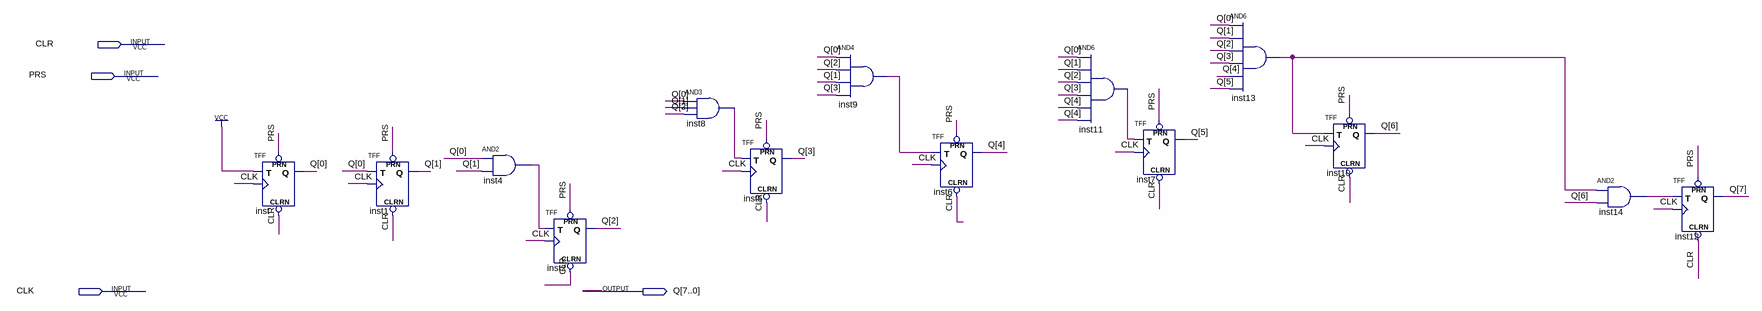
[diagram p0: schematic sheet]
// Quartus schematic counter.bdf as structural Verilog: 14 symbols, 4 pins
module counter (
  input  CLR,
  input  PRS,
  input  CLK,
  output [7:0] Q
);

  wire inst4_out, inst8_out, inst9_out, inst11_out, inst13_out, inst14_out;

  TFF inst (.PRN(PRS), .CLRN(CLR), .T(1'b1), .CLK(CLK), .Q(Q[0]));
  TFF inst1 (.PRN(PRS), .CLRN(CLR), .T(Q[0]), .CLK(CLK), .Q(Q[1]));
  and inst4 (inst4_out, Q[0], Q[1]);
  TFF inst2 (.PRN(PRS), .CLRN(CLR), .T(inst4_out), .CLK(CLK), .Q(Q[2]));
  and inst8 (inst8_out, Q[0], Q[1], Q[2]);
  TFF inst5 (.PRN(PRS), .CLRN(CLR), .T(inst8_out), .CLK(CLK), .Q(Q[3]));
  and inst9 (inst9_out, Q[0], Q[2], Q[1], Q[3]);
  TFF inst6 (.PRN(PRS), .CLRN(CLR), .T(inst9_out), .CLK(CLK), .Q(Q[4]));
  and inst11 (inst11_out, Q[0], Q[1], Q[2], Q[3], Q[4], Q[4]);
  TFF inst7 (.PRN(PRS), .CLRN(CLR), .T(inst11_out), .CLK(CLK), .Q(Q[5]));
  and inst13 (inst13_out, Q[0], Q[1], Q[2], Q[3], Q[4], Q[5]);
  TFF inst10 (.PRN(PRS), .CLRN(CLR), .T(inst13_out), .CLK(CLK), .Q(Q[6]));
  and inst14 (inst14_out, inst13_out, Q[6]);
  TFF inst12 (.PRN(PRS), .CLRN(CLR), .T(inst14_out), .CLK(CLK), .Q(Q[7]));
endmodule
